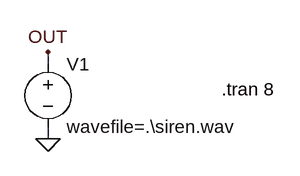
[diagram p0: schematic ImportSiren.asc]
ImportSiren.asc, the LTspice schematic file:
Version 4
SHEET 1 1112 680
WIRE -16 240 -16 224
WIRE -16 336 -16 320
FLAG -16 336 0
FLAG -16 224 OUT
SYMBOL voltage -16 224 R0
WINDOW 123 0 0 Left 0
WINDOW 39 0 0 Left 0
SYMATTR InstName V1
SYMATTR Value wavefile=.\siren.wav
TEXT 208 272 Left 0 !.tran 8

The netlist it stands for:
* ImportSiren.asc
V1 OUT 0 wavefile=.\siren.wav
.tran 8
.backanno
.end